# EAGLE design TS2068-CARTRIDGE-2012 (EAGLE 5.10)
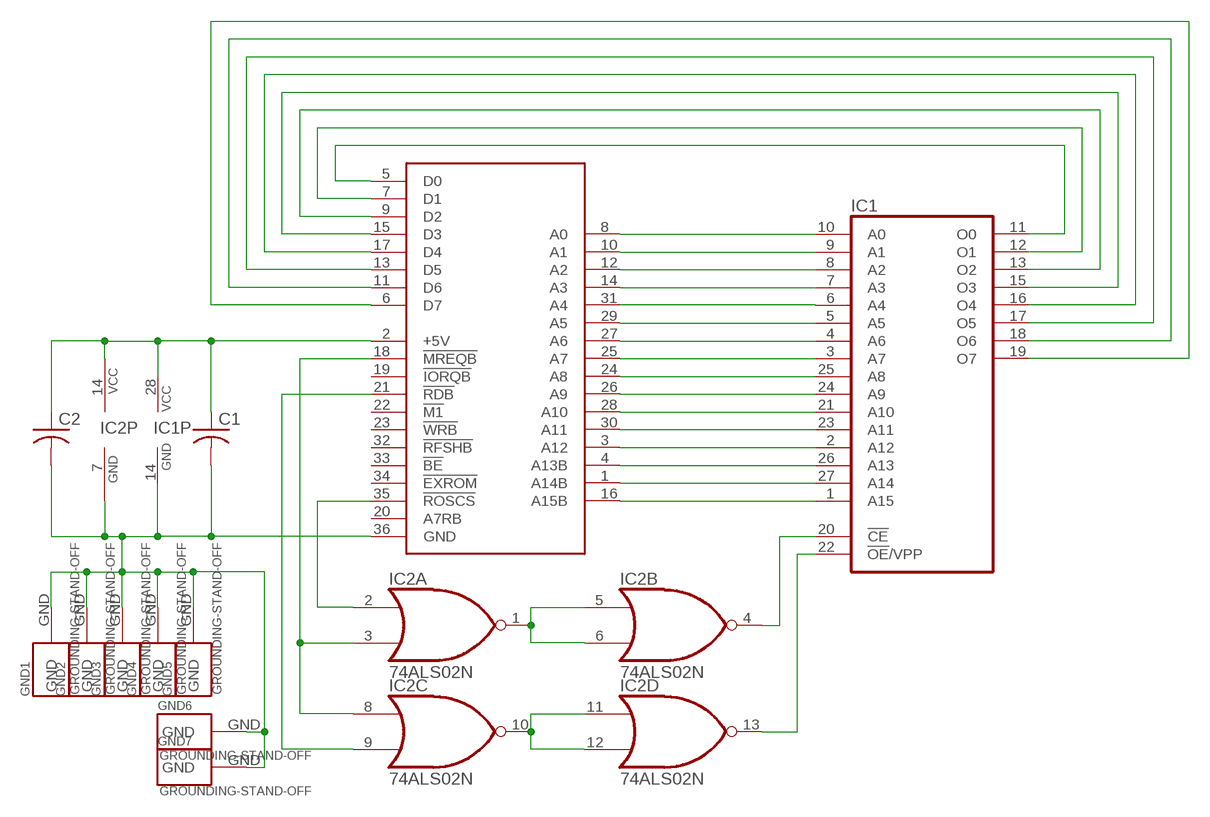
[diagram p0: schematic, sheet 1]

## Parts
C1  NP-CAPACITOR-C050-025X075  [C050-025X075]
C2  NP-CAPACITOR-C050-025X075  [C050-025X075]
GND1  GROUNDING-STAND-OFF  [STAND-OFF]
GND2  GROUNDING-STAND-OFF  [STAND-OFF]
GND3  GROUNDING-STAND-OFF  [STAND-OFF]
GND4  GROUNDING-STAND-OFF  [STAND-OFF]
GND5  GROUNDING-STAND-OFF  [STAND-OFF]
GND6  GROUNDING-STAND-OFF  [STAND-OFF]
GND7  GROUNDING-STAND-OFF  [STAND-OFF]
IC1  27C512D  [DIL28-6]
IC2  74ALS02N  [DIL14]
TS1  TS2068-CARTRIDGE-FULL-P.C.B.  [TS2068-ROM-CARTRIDGE]

## Nets
GND [power]: C1.2(-) C2.2(-) GND1.GND GND2.GND GND3.GND GND4.GND GND5.GND GND6.GND GND7.GND IC1.14(GND) IC2.7(P:GND) TS1.36(GND)
N$1: IC1.10(A0) TS1.8(A0)
N$2: IC1.9(A1) TS1.10(A1)
N$3: IC1.8(A2) TS1.12(A2)
N$4: IC1.7(A3) TS1.14(A3)
N$5: IC1.6(A4) TS1.31(A4)
N$6: IC1.5(A5) TS1.29(A5)
N$7: IC1.4(A6) TS1.27(A6)
N$8: IC1.3(A7) TS1.25(A7)
N$9: IC1.25(A8) TS1.24(A8)
N$10: IC1.24(A9) TS1.26(A9)
N$11: IC1.21(A10) TS1.28(A10)
N$12: IC1.23(A11) TS1.30(A11)
N$13: IC1.2(A12) TS1.3(A12)
N$14: IC1.26(A13) TS1.4(A13B)
N$15: IC1.27(A14) TS1.1(A14B)
N$16: IC1.1(A15) TS1.16(A15B)
N$17: IC1.11(O0) TS1.5(D0)
N$18: IC1.12(O1) TS1.7(D1)
N$19: IC1.13(O2) TS1.9(D2)
N$20: IC1.15(O3) TS1.15(D3)
N$21: IC1.16(O4) TS1.17(D4)
N$22: IC1.17(O5) TS1.13(D5)
N$23: IC1.18(O6) TS1.11(D6)
N$24: IC1.19(O7) TS1.6(D7)
N$30: IC2.1(A:O) IC2.5(B:I0) IC2.6(B:I1)
N$31: IC2.10(C:O) IC2.11(D:I0) IC2.12(D:I1)
N$32: IC1.20(!CE) IC2.4(B:O)
N$33: IC1.22(!OE!/VPP) IC2.13(D:O)
N$34: IC2.3(A:I1) IC2.8(C:I0) TS1.18(!MREQB)
N$35: IC2.2(A:I0) TS1.35(!ROSCS)
N$36: IC2.9(C:I1) TS1.21(!RDB)
VCC [power]: C1.1(+) C2.1(+) IC1.28(VCC) IC2.14(P:VCC) TS1.2(+5V)
Unconnected: TS1.19(!IORQB) TS1.20(A7RB) TS1.22(!M1) TS1.23(!WRB) TS1.32(!RFSHB) TS1.33(!BE) TS1.34(!EXROM)

## Library data of the parts
C1 C2 = GIMEchip-Capacitor:NP-CAPACITOR: NON-POLARIZED CAPACITOR grid 5mm
GND1-GND7 = GIMEchip-Grounding:GROUNDING
IC1 = GIMEchip-EPROM:27C512D: MEMORY
IC2 = GIMEchip-74xx-us:74*02: Quad 2-input NOR gate
TS1 = GIMEchip-TS2068-ROM-Cartridge:TS2068-CARTRIDGE

## Net classes
0 default: width 0.254 mm, clearance 0.203 mm
1 power: width 0.762 mm, clearance 0.203 mm

## Board
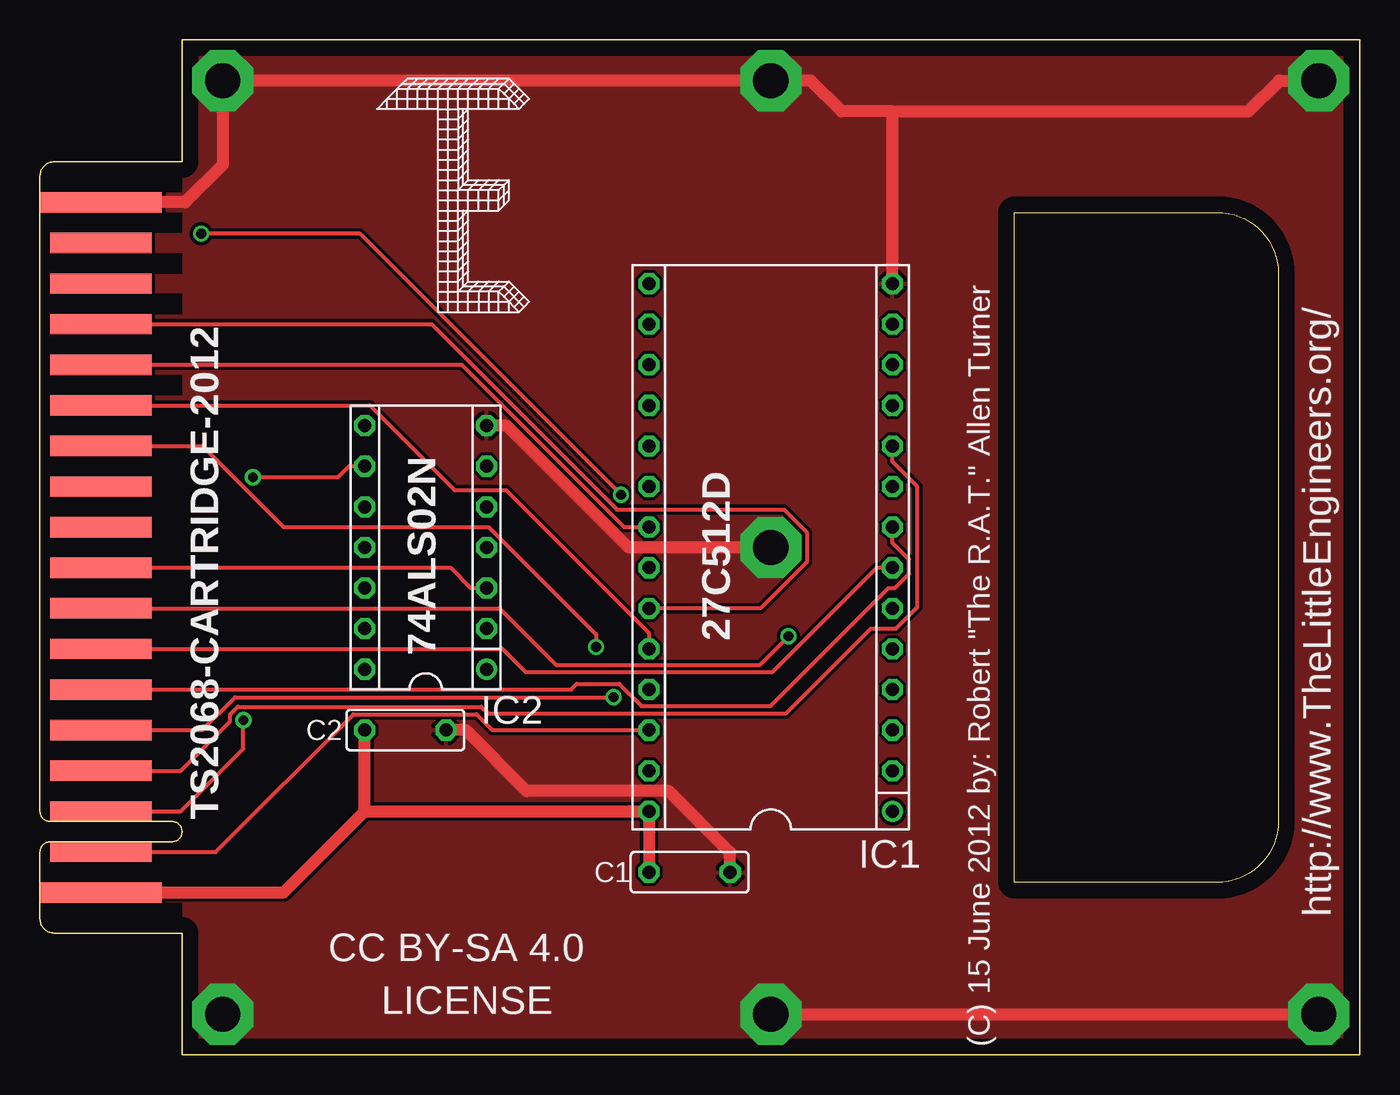
[diagram p1: board, top side]
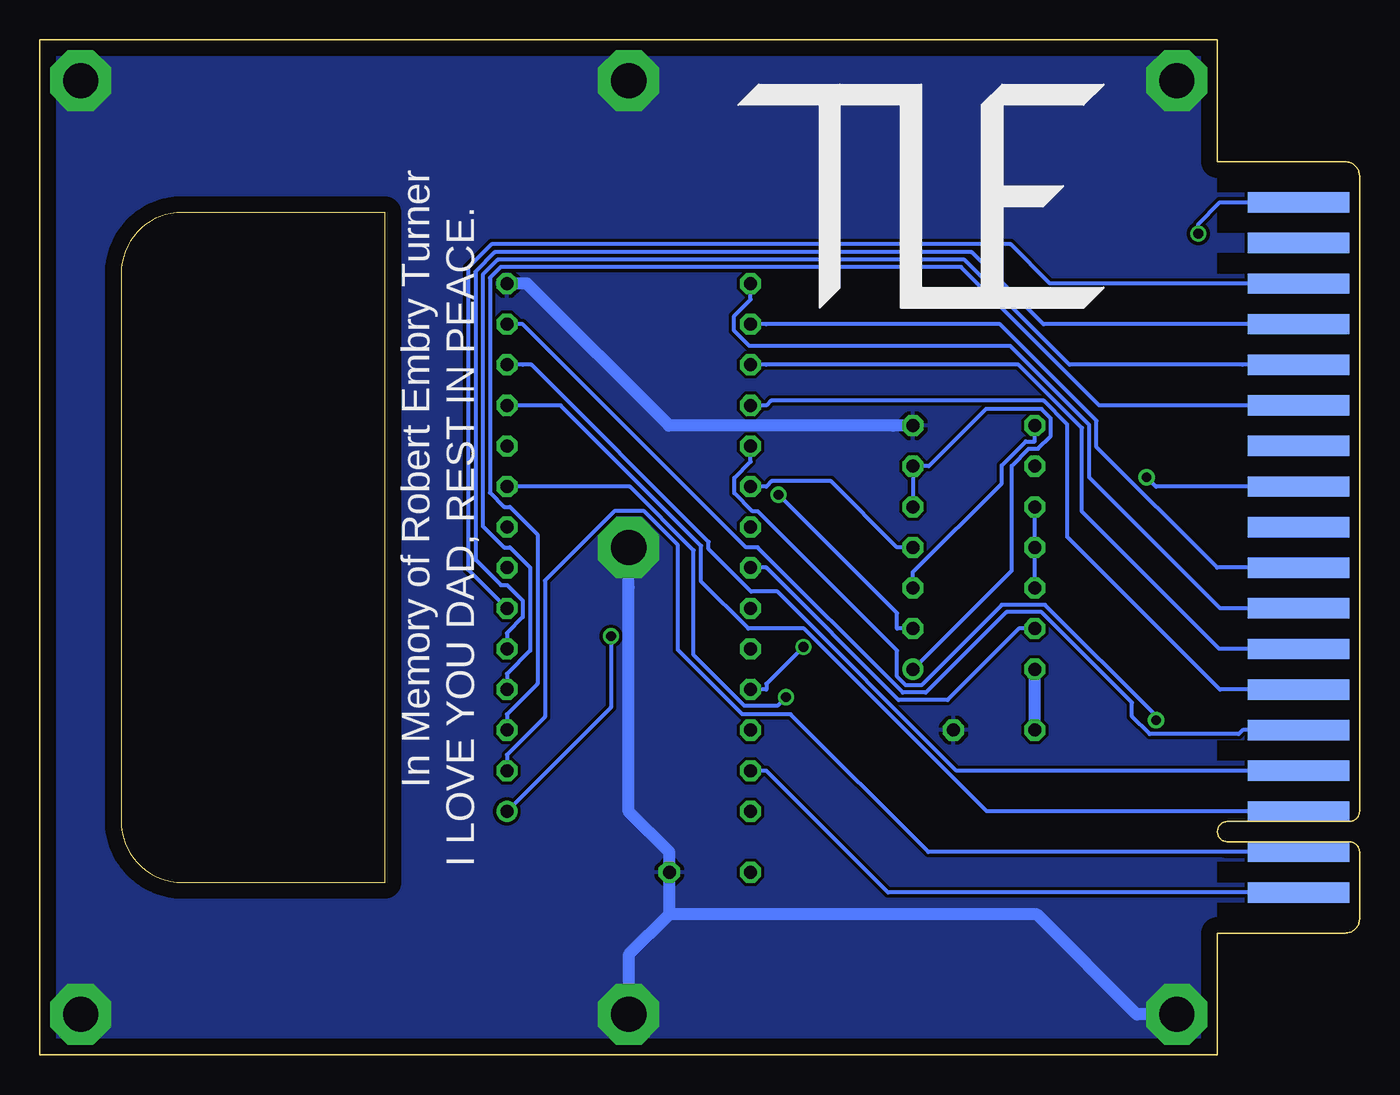
[diagram p2: board, bottom side, seen from below]

Size 82.55 x 63.5 mm. Coordinates in mm from the lower left corner, seen from the top.
Outline: 8.89,63.5 8.89,55.88 0.9,55.88 arc90 0,54.98 0,15.24 arc90 0.64,14.61 8.26,14.61 arc-90 8.89,13.97 arc-90 8.26,13.34 0.64,13.34 arc90 0,12.7 0,8.52 arc90 0.9,7.62 8.89,7.62 8.89,0 82.55,0 82.55,63.5 8.89,63.5
Outline: 60.96,52.7 73.66,52.7 arc-90 77.47,48.9 77.47,14.61 arc-90 73.66,10.79 60.96,10.79 60.96,52.7
Copper layers (1*16): Top 0.035mm / dielectric 1.5mm / Bottom 0.035mm
Design rules "default": minimum track width 10mil, minimum drill 24mil, track to track 8mil, track to pad 8mil, pad to pad 8mil, via to via 8mil, smd to smd 8mil, copper to edge 40mil, drill to drill 8mil, minimum pad ring 10mil, minimum via ring 8mil, stop-mask expansion 4mil, vias tented up to drill 0mil, thermal gap 10mil

### Footprints (pad centres in the part's own frame; a part is rotated, then mirrored left to right if it is on the bottom)
C050-025X075 = drill 0.813 octagon: 1 -2.54,0; 2 2.54,0
STAND-OFF = drill 2.2 pad 3.81 octagon: GND 0,0
DIL28-6 = drill 0.813 round: 1 -16.51,-7.62 | drill 0.813 octagon: 2 -13.97,-7.62; 3 -11.43,-7.62; 4 -8.89,-7.62; 5 -6.35,-7.62; 6 -3.81,-7.62; 7 -1.27,-7.62; 8 1.27,-7.62; 9 3.81,-7.62; 10 6.35,-7.62; 11 8.89,-7.62; 12 11.43,-7.62; 13 13.97,-7.62; 14 16.51,-7.62; 15 16.51,7.62; 16 13.97,7.62; 17 11.43,7.62; 18 8.89,7.62; 19 6.35,7.62; 20 3.81,7.62; 21 1.27,7.62; 22 -1.27,7.62; 23 -3.81,7.62; 24 -6.35,7.62; 25 -8.89,7.62; 26 -11.43,7.62; 27 -13.97,7.62; 28 -16.51,7.62
DIL14 = drill 0.813 round: 1 -7.62,-3.81 | drill 0.813 octagon: 2 -5.08,-3.81; 3 -2.54,-3.81; 4 0,-3.81; 5 2.54,-3.81; 6 5.08,-3.81; 7 7.62,-3.81; 8 7.62,3.81; 9 5.08,3.81; 10 2.54,3.81; 11 0,3.81; 12 -2.54,3.81; 13 -5.08,3.81; 14 -7.62,3.81
TS2068-ROM-CARTRIDGE = smd 6.35 x 1.27 bottom: 1 3.81,-19.05; 3 3.81,-16.51; 5 3.81,-13.97; 7 3.81,-11.43; 9 3.81,-8.89; 11 3.81,-6.35; 13 3.81,-3.81; 15 3.81,-1.27; 17 3.81,1.27; 19 3.81,3.81; 21 3.81,6.35; 23 3.81,8.89; 25 3.81,11.43; 27 3.81,13.97; 29 3.81,16.51; 31 3.81,19.05; 33 3.81,21.59; 35 3.81,24.13 | smd 7.62 x 1.27: 2 3.81,-19.05; 36 3.81,24.13 | smd 6.35 x 1.27: 4 3.81,-16.51; 6 3.81,-13.97; 8 3.81,-11.43; 10 3.81,-8.89; 12 3.81,-6.35; 14 3.81,-3.81; 16 3.81,-1.27; 18 3.81,1.27; 20 3.81,3.81; 22 3.81,6.35; 24 3.81,8.89; 26 3.81,11.43; 28 3.81,13.97; 30 3.81,16.51; 32 3.81,19.05; 34 3.81,21.59

### Placement (x,y rotation side)
C1  40.64,11.43 0 top
C2  22.86,20.32 0 top
GND1  11.43,60.96 0 top
GND2  80.01,60.96 0 top
GND3  11.43,2.54 0 top
GND4  80.01,2.54 0 top
GND5  45.72,31.75 0 top
GND6  45.72,60.96 0 top
GND7  45.72,2.54 0 top
IC1  45.72,31.75 90 top
IC2  24.13,31.75 90 top
TS1  0,29.21 0 top
U$1  [TLE-LOGO-14]  33.78,46.74 0 bottom
U$2  [TLE-LOGO-10]  21.08,46.48 0 top

### Tracks (layer width: path | path; a pad name or v marks a point on that pad's centre or on a via)
GND
  Top 0.762: IC2.7 29.18,39.37 36.8,31.75 GND5.GND | GND7.GND GND4.GND | 53.34,59.04 75.6,59.04 77.52,60.96 GND2.GND | 53.34,59.04 50.13,59.04 48.21,60.96 GND6.GND 13.92,60.96 GND1.GND 11.43,55.67 9.1,53.34 TS1.36 | 53.34,59.04 53.34,49.51 IC1.14 | C2.2 26.64,20.32 30.45,16.51 39.34,16.51 43.18,12.68 C1.2
  Bottom 0.762: IC1.14 52.09,48.26 43.2,39.37 29.18,39.37 IC2.7 | GND5.GND 45.72,29.26 45.72,15.21 43.18,12.68 C1.2 43.18,10.19 43.18,8.79 | 43.18,8.79 20.17,8.79 13.92,2.54 GND3.GND | GND7.GND 45.72,6.25 43.18,8.79
  pour Bottom: 0,0 0,63.5 82.55,63.5 82.55,0
  pour Top: 0,0 0,63.5 82.55,63.5 82.55,0
N$1
  Top 0.254: TS1.8 8.8,17.78 11.89,20.87 11.89,21.3 12.38,21.79 27.61,21.79 28.02,21.37 46.67,21.37 51.97,26.67 53.54,26.67 54.89,28.02 54.89,35.56 53.34,37.11 IC1.10
N$2  (via drill 0.61 pad 1.02)
  Top 0.254: v35.89,22.38 12.2,22.38 10.15,20.32 TS1.10
  Bottom 0.254: IC1.9 45.65,35.56 41.66,31.57 41.66,25.02 38.49,21.84 36.42,21.84 v35.89,22.38
N$3
  Top 0.254: TS1.12 33.23,22.86 33.58,23.21 36.23,23.21 37.62,21.83 45.71,21.83 53.09,29.21 53.48,29.21 54.37,30.1 54.37,31 53.34,32.03 IC1.8
N$4
  Top 0.254: IC1.7 52.35,30.48 45.82,23.95 30.38,23.95 28.93,25.4 TS1.14
N$5
  Bottom 0.254: TS1.31 19.36,48.26 21.81,50.72 54.3,50.72 55.77,49.25 55.77,30.37 IC1.6
N$6
  Bottom 0.254: TS1.29 19.77,45.72 24.26,50.21 54.1,50.21 55.31,49 55.31,30.99 53.71,29.39 53.32,29.39 52.35,28.42 52.35,27.39 53.34,26.39 IC1.5
N$7
  Bottom 0.254: TS1.27 7.32,43.18 | 7.32,43.18 18.14,43.18 24.72,49.75 53.91,49.75 54.85,48.81 54.85,33.09 53.51,31.75 53.15,31.75 51.89,30.49 51.89,25.3 53.34,23.85 IC1.4 | 7.32,43.18
N$8
  Bottom 0.254: IC1.3 53.34,21.31 51.43,23.22 51.43,32.57 53.15,34.29 53.51,34.29 54.4,35.17 54.4,48.62 53.72,49.3 24.94,49.3 16.28,40.64 TS1.25
N$9  (via drill 0.61 pad 1.02)
  Top 0.254: TS1.24 10.18,38.1 15.26,33.02 28.08,33.02 34.79,26.31 v34.79,25.53
  Bottom 0.254: IC1.25 37.11,22.86 37.11,23.21 v34.79,25.53
N$10
  Top 0.254: TS1.26 20.64,40.64 25.95,35.33 29.16,35.33 38.1,26.39 IC1.24
N$11
  Top 0.254: TS1.28 7.32,43.18 26.38,43.18 36.54,33.02 37.11,33.02 IC1.21
N$12
  Top 0.254: TS1.30 24.49,45.72 | 24.49,45.72 | 24.49,45.72 36.09,34.12 46.55,34.12 47.97,32.7 47.97,30.84 45.07,27.94 IC1.23
N$13
  Bottom 0.254: IC1.2 53.34,18.77 50.96,21.16 50.96,29.68 46.62,34.02 44.76,34.02 42.64,31.9 42.64,25.35 38.6,21.31 35.59,21.31 26.98,12.7 TS1.3
N$14
  Top 0.254: TS1.4 10.99,12.7 19.61,21.32 27.3,21.32 28.3,20.32 IC1.26
N$15
  Bottom 0.254: IC1.27 37.11,17.78 29.49,10.16 TS1.1
N$16  (via drill 0.61 pad 1.02)
  Top 0.254: TS1.16 28.75,27.94 32.28,24.41 45.05,24.41 v46.83,26.19
  Bottom 0.254: IC1.1 46.83,21.75 v46.83,26.19
N$17
  Bottom 0.254: IC1.11 49.98,40.64 41.18,31.84 41.18,29.61 38.24,26.67 34.74,26.67 23.31,15.24 7.32,15.24 | 7.32,15.24 | TS1.5 7.32,15.24
N$18
  Bottom 0.254: TS1.7 7.32,17.78 25.21,17.78 36.41,28.98 38.06,28.98 40.73,31.64 40.73,32.09 51.81,43.18 52.35,43.18 IC1.12
N$19
  Bottom 0.254: TS1.9 7.32,20.32 7.57,20.07 13.12,20.07 14.23,21.18 14.23,22.04 19.89,27.7 22.09,27.7 27.13,22.66 28.58,22.66 37.66,31.75 | 37.66,31.75 | 37.66,31.75 38.38,31.75 52.35,45.72 IC1.13
N$20
  Bottom 0.254: TS1.15 8.72,27.94 16.91,36.12 16.91,39.41 21.84,44.35 38.17,44.35 39.13,45.31 39.13,46.24 38.1,47.27 IC1.15
N$21
  Bottom 0.254: TS1.17 8.9,30.48 16.45,38.03 16.45,39.68 22.49,45.72 37.11,45.72 IC1.16
N$22
  Bottom 0.254: TS1.13 8.78,25.4 17.37,33.99 17.37,39.22 21.33,43.18 37.11,43.18 IC1.17
N$23
  Bottom 0.254: IC1.18 37.11,40.64 36.82,40.93 19.76,40.93 18.28,39.45 18.28,32.41 8.73,22.86 TS1.11
N$24  (via drill 0.61 pad 1.02)
  Top 0.254: TS1.6 8.81,15.24 12.72,19.15 v12.72,20.95
  Bottom 0.254: IC1.19 38.1,37.11 39.11,36.1 39.11,35.15 37.97,34.01 37.64,34.01 28.93,25.3 28.93,23.66 28.39,23.12 27.41,23.12 22.38,28.16 19.67,28.16 12.72,21.21 v12.72,20.95
N$30
  Bottom 0.254: IC2.1 21.76,30.31 21.76,36.86 20.7,37.92 20.12,37.92 19.31,38.73 19.31,39.82 19.9,40.41 23.37,40.41 26.95,36.83 IC2.6 IC2.5
N$31
  Bottom 0.254: IC2.10 IC2.11 IC2.12
N$32
  Bottom 0.254: IC1.20 37.11,35.56 36.78,35.89 33.07,35.89 28.93,31.75 IC2.4
N$33
  Bottom 0.254: IC1.22 37.11,30.48 28.84,22.21 25.77,22.21 21.31,26.67 IC2.13
N$34
  Top 0.254: IC2.3 26.95,29.21 25.68,30.48 TS1.18
  Bottom 0.254: IC2.8 20.32,38.38 20.89,38.38 22.38,36.88 22.38,35.76 27.94,30.2 IC2.3
N$35  (via drill 0.61 pad 1.02)
  Top 0.254: v36.34,35.05 20.02,51.38 v10.08,51.38
  Bottom 0.254: IC2.2 28.93,26.67 28.93,27.64 v36.34,35.05 | TS1.35 8.73,53.34 10.08,51.99 v10.08,51.38
N$36  (via drill 0.61 pad 1.02)
  Top 0.254: IC2.9 19.33,36.83 18.64,36.14 v13.32,36.14
  Bottom 0.254: TS1.21 12.74,35.56 v13.32,36.14
VCC
  Top 0.762: 20.32,15.24 15.24,10.16 TS1.2 | 20.32,15.24 20.32,19.07 C2.1 | 20.32,15.24 36.85,15.24 IC1.28 C1.1
  Bottom 0.762: C2.1 IC2.14

### Text on the board
tPlace: 27C512D | TS2068-CARTRIDGE-2012 | http://www.TheLittleEngineers.org/ | CC BY-SA 4.0 | LICENSE | (C) 15 June 2012 by: Robert "The R.A.T." Allen Turner
bPlace: In Memory of Robert Embry Turner | I LOVE YOU DAD, REST IN PEACE.